# EAGLE design Wiring-Board-Nano_lay (EAGLE 7.4.0)
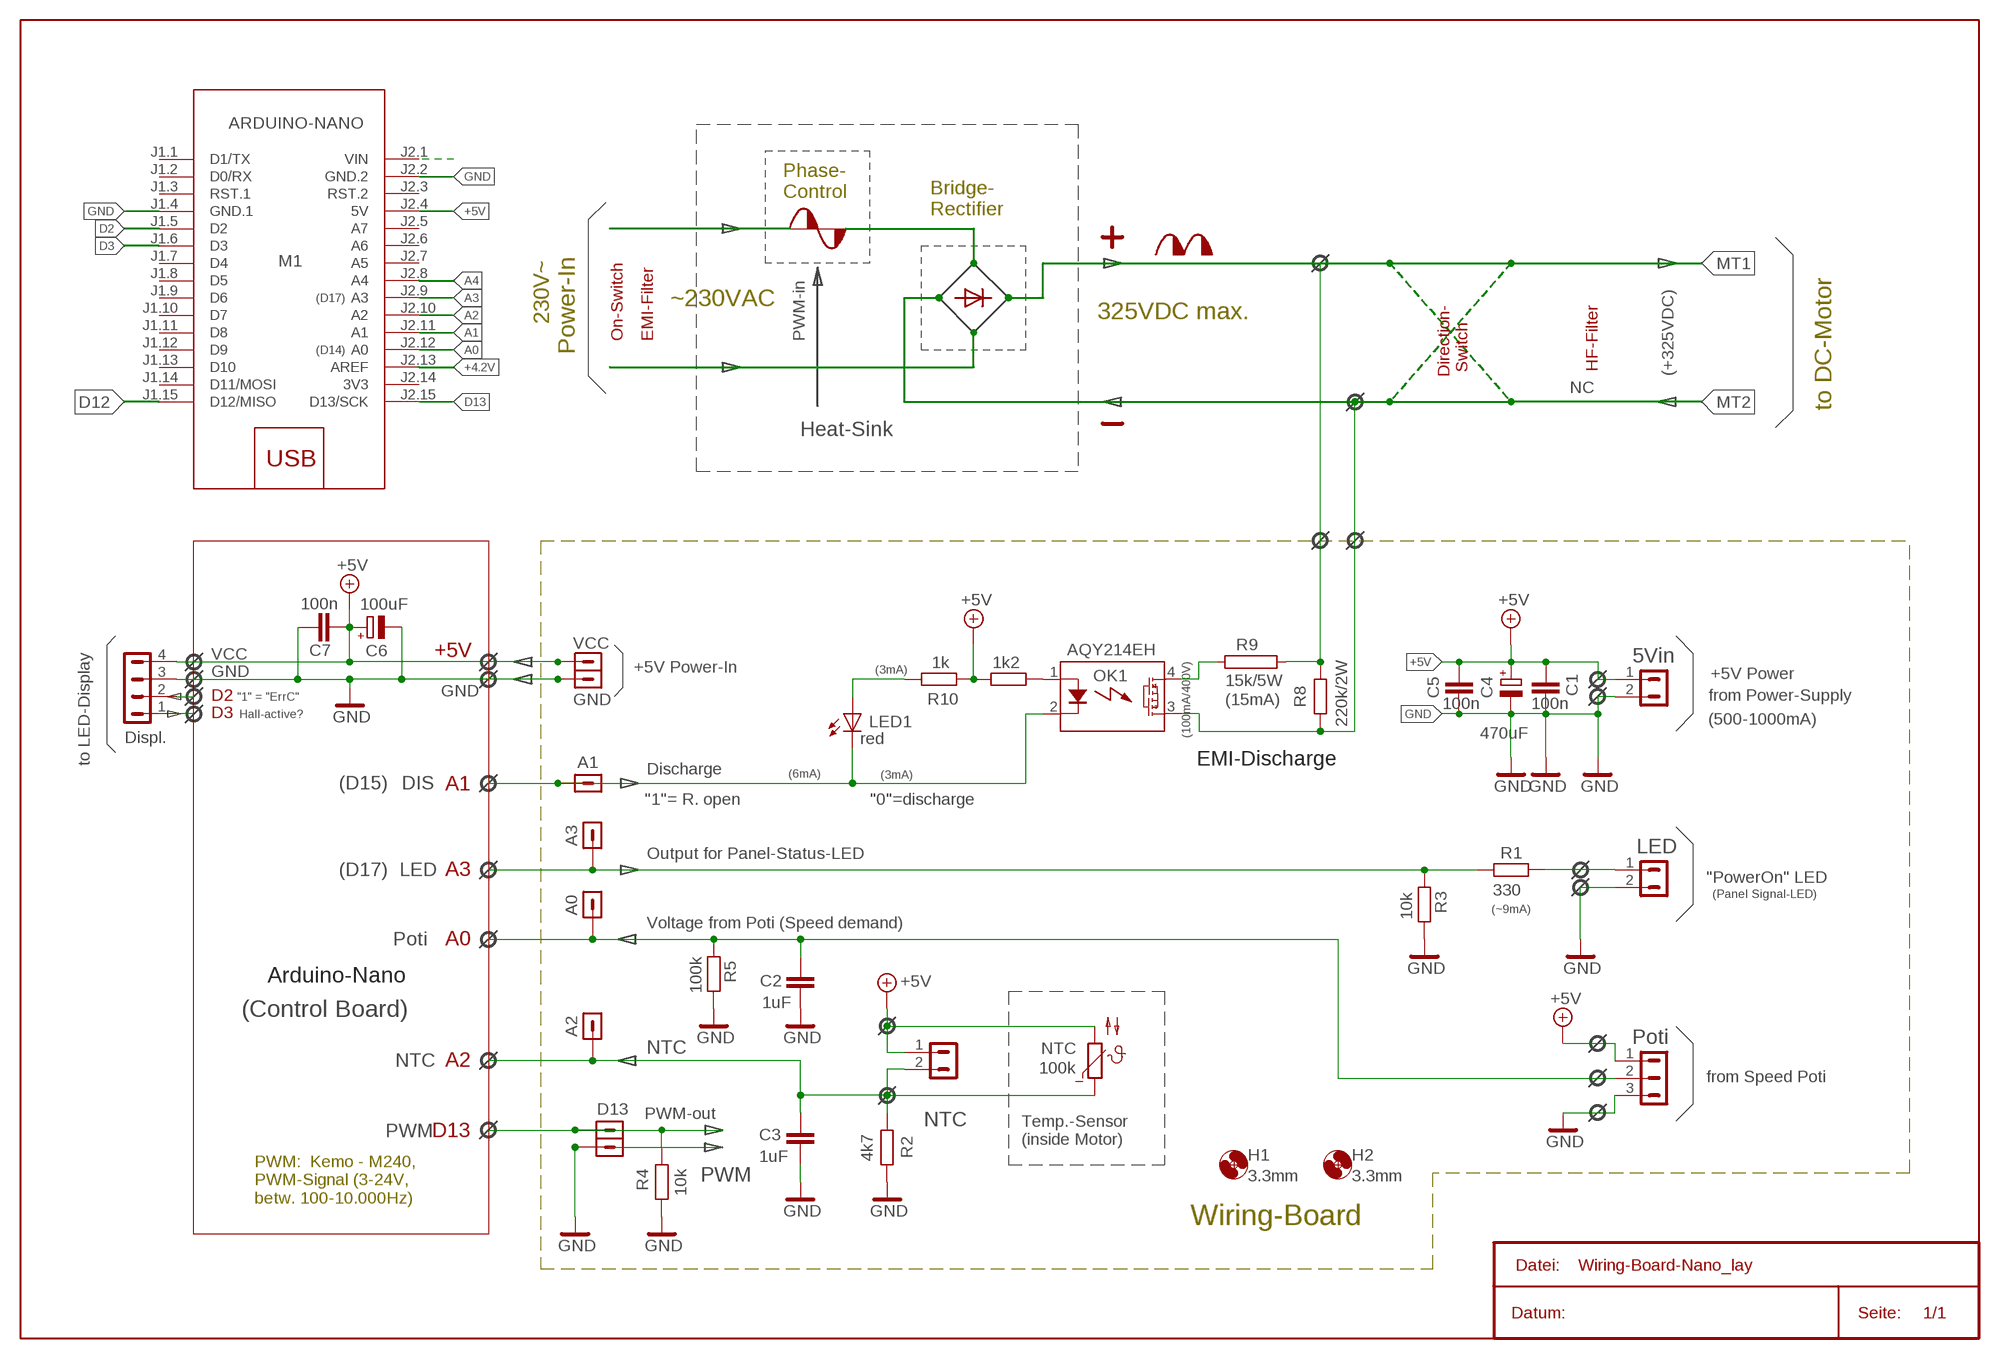
[diagram p0: schematic, sheet 1]

## Parts
C1  100n  C-EUC0805  [C0805]
C2  1uF  C-EUC0805  [C0805]
C3  1uF  C-EUC0805  [C0805]
C4  470uF  CPOL-EUE3.5-8  [E3,5-8]
C5  100n  C-EUC0805  [C0805]
C6  100uF  CPOL-EUE2.5-7  [E2,5-7]
C7  100n  C-EUC0805  [C0805]
H1  3.3mm  MOUNT-HOLE3.3  [3,3]
H2  3.3mm  MOUNT-HOLE3.3  [3,3]
LED1  red  LEDCHIPLED_0805  [CHIPLED_0805]
M1  ARDUINO-NANO  ARDUINO-NANO-3.0  [ARDUINO-NANO-3.0]
OK1  AQY214EH  AQY  [GULLWING]
R1  330  R-EU_R0805  [R0805]
R2  4k7  R-EU_R0805  [R0805]
R3  10k  R-EU_R0805  [R0805]
R4  10k  R-EU_R0805  [R0805]
R5  100k  R-EU_R0805  [R0805]
R8  220k/2W  R-EU_0309/12  [0309/12]
R9  15k/5W  RKH206-8  [KH206-8]
R10  1k  R-EU_R0805  [R0805]
R11  1k2  R-EU_R0805  [R0805]
SV1  5Vin  MA02-10  [MA02-1]
SV2  LED  MA02-10  [MA02-1]
SV3  Poti  MA03-10  [MA03-1]
SV4  NTC  MA02-10  [MA02-1]
SV6  Displ.  MA04-10  [MA04-1]

## Nets
+4.2V: M1.J2.13(AREF)
+5V: C1.1 C4.+ C5.1 C6.+ C7.1 M1.J2.4(5V) R10.2 R11.1 SV1.1 SV3.1 SV4.1 SV6.4
A0: C2.1 M1.J2.12(A0) R5.1 SV3.2
A1: LED1.C M1.J2.11(A1) OK1.2(K)
A2: C3.1 M1.J2.10(A2) R2.2 SV4.2
A3: M1.J2.9(A3) R1.1 R3.1
A4: M1.J2.8(A4)
D2: M1.J1.5(D2) SV6.2
D3: M1.J1.6(D3) SV6.1
D12: M1.J1.15(D12/MISO)
D13: M1.J2.15(D13/SCK) R4.1
GND: C1.2 C2.2 C3.2 C4.- C5.2 C6.- C7.2 M1.J1.4(GND.1) M1.J2.2(GND.2) R2.1 R3.2 R4.2 R5.2 SV1.2 SV2.2 SV3.3 SV6.3
MINUS: OK1.3(DS2) R8.1
MT1: R8.2 R9.2
N$1: OK1.1(A) R11.2
N$3: R1.2 SV2.1
N$7: M1.J2.1(VIN)
N$8: OK1.4(DS1) R9.1
N$18: LED1.A R10.1
Unconnected: M1.J1.1(D1/TX) M1.J1.2(D0/RX) M1.J1.3(RST.1) M1.J1.7(D4) M1.J1.8(D5) M1.J1.9(D6) M1.J1.10(D7) M1.J1.11(D8) M1.J1.12(D9) M1.J1.13(D10) M1.J1.14(D11/MOSI) M1.J2.3(RST.2) M1.J2.5(A7) M1.J2.6(A6) M1.J2.7(A5)

## Notes on the sheet
- Phase-
  Control
- Bridge-
  Rectifier
- (D17)
- ~230VAC
- 230V~ | 325VDC max.
- On-Switch | EMI-Filter | PWM-in
- (D14)
- Power-In
- HF-Filter | (+325VDC)
- Direction-
   Switch
- NC
- to DC-Motor
- Heat-Sink
- VCC
- VCC | +5V
- GND | +5V Power-In | (3mA)
- +5V Power
- D2 | GND
- "1" = "ErrC" | from Power-Supply
- GND | (15mA)
- D3 | Hall-active?
- (500-1000mA)
- (100mA/400V)
- to LED-Display | A1 | EMI-Discharge
- Discharge | (6mA)
- (3mA)
- (D15) | DIS | A1
- "1"= R. open | "0"=discharge
- A3
- Output for Panel-Status-LED
- (D17) | LED | A3
- "PowerOn" LED
- (Panel Signal-LED)
- A0 | (~9mA)
- Voltage from Poti (Speed demand)
- Poti | A0
- Arduino-Nano
- (Control Board)
- A2
- NTC | NTC
- NTC | A2
- 100k
- from Speed Poti
- D13 | PWM-out
- PWM | D13
- Temp.-Sensor
  (inside Motor)
- PWM
- PWM:  Kemo - M240,
  PWM-Signal (3-24V,
  betw. 100-10.000Hz)
- Wiring-Board

## Power pins joined to a net without a drawn wire
3V3: M1.J2.14(3V3)

## Library data of the parts
C1-C3 C5 C7 = rcl1:C-EU: CAPACITOR, European symbol
C4 C6 = rcl1:CPOL-EU: POLARIZED CAPACITOR, European symbol
H1 H2 = holes:MOUNT-HOLE: MOUNTING HOLE with drill center marker
LED1 = led:LED: LED OSRAM: - CHIPLED LG R971, LG N971, LY N971, LG Q971, LY Q971, LO R971, LY R971 LH N974, LH R974 LS Q976, LO Q976, LY Q976 LO Q996 - Hyper CHIPLED LW Q18S LB Q993, LB Q99A, LB R99A - SideLED LS A670, LO A670, LY A670, LG A670, LP A670 LB A673, LV A673, LT A673, LW A673 LH A674 LY A675 LS A676, LA A676, LO A676, LY A676, LW A676 LS A679, LY A679, LG A679 - Hyper Micro SIDELED® LS Y876, LA Y876, LO Y876, LY Y876 LT Y87S - SmartLED LW L88C, LW L88S LB L89C, LB L89S, LG L890 LS L89K, LO L89K, LY L89K LS L896, LA L896, LO L896, LY L896 - TOPLED LS T670, LO T670, LY T670, LG T670, LP T670 LSG T670, LSP T670, LSY T670, LOP T670, LYG T670 LG T671, LOG T671, LSG T671 LB T673, LV T673, LT T673, LW T673 LH T674 LS T676, LA T676, LO T676, LY T676, LB T676, LH T676, LSB T676, LW T676 LB T67C, LV T67C, LT T67C, LS T67K, LO T67K, LY T67K, LW E67C LS E67B, LA E67B, LO E67B, LY E67B, LB E67C, LV E67C, LT E67C LW T67C LS T679, LY T679, LG T679 LS T770, LO T770, LY T770, LG T770, LP T770 LB T773, LV T773, LT T773, LW T773 LH T774 LS E675, LA E675, LY E675, LS T675 LS T776, LA T776, LO T776, LY T776, LB T776 LHGB T686 LT T68C, LB T68C - Hyper Mini TOPLED® LB M676 - Mini TOPLED Santana® LG M470 LS M47K, LO M47K, LY M47K Source: http://www.osram.convergy.de LUXEON: - LUMILED® LXK2-PW12-R00, LXK2-PW12-S00, LXK2-PW14-U00, LXK2-PW14-V00 LXK2-PM12-R00, LXK2-PM12-S00, LXK2-PM14-U00 LXK2-PE12-Q00, LXK2-PE12-R00, LXK2-PE12-S00, LXK2-PE14-T00, LXK2-PE14-U00 LXK2-PB12-K00, LXK2-PB12-L00, LXK2-PB12-M00, LXK2-PB14-N00, LXK2-PB14-P00, LXK2-PB14-Q00 LXK2-PR12-L00, LXK2-PR12-M00, LXK2-PR14-Q00, LXK2-PR14-R00 LXK2-PD12-Q00, LXK2-PD12-R00, LXK2-PD12-S00 LXK2-PH12-R00, LXK2-PH12-S00 LXK2-PL12-P00, LXK2-PL12-Q00, LXK2-PL12-R00 Source: www.luxeon.com KINGBRIGHT: KA-3528ASYC Source: www.kingbright.com
M1 = diy-modules:ARDUINO-NANO-3.0: Arduino Nano 3.0 and compatible devices More details available here: https://www.arduino.cc/en/Main/ArduinoBoardNano Click here to find device on ebay.com <http://www.ebay.com/sch/arduino+nano>
OK1 = relay:AQY*: PhotoMOS Relay NAiS Source: http://www.panasonic-electric-works.com/catalogues/downloads/photomos/ds_x615_en_aqz10_20.pdf
R1-R5 R8 R10 R11 = rcl1:R-EU_: RESISTOR, European symbol
R9 = resistor-power:R: Power Resitor; OC_FARNELL: unknown; OC_NEWARK: unknown
SV1 SV2 SV4 = con-lstc:MA02-1: PIN HEADER
SV3 = con-lstc:MA03-1: PIN HEADER; OC_FARNELL: unknown; OC_NEWARK: unknown
SV6 = con-lstc:MA04-1: PIN HEADER; OC_FARNELL: unknown; OC_NEWARK: unknown

## Board
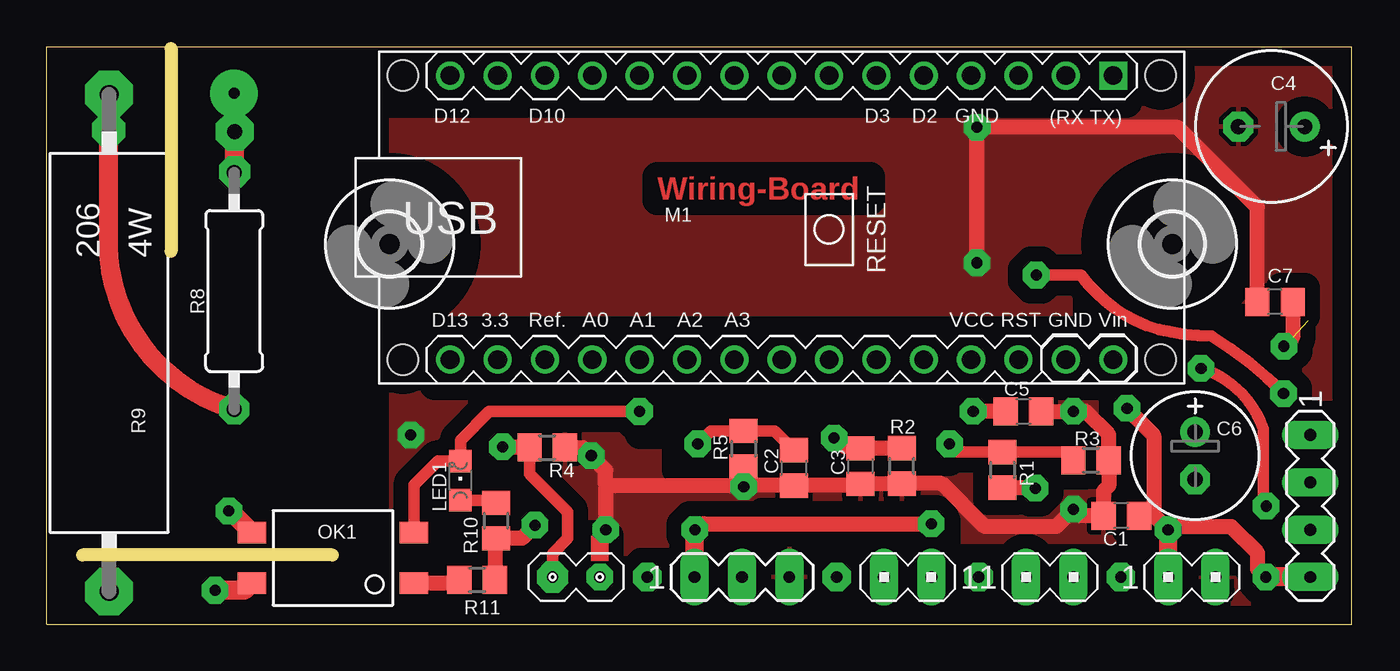
[diagram p1: board, top side]
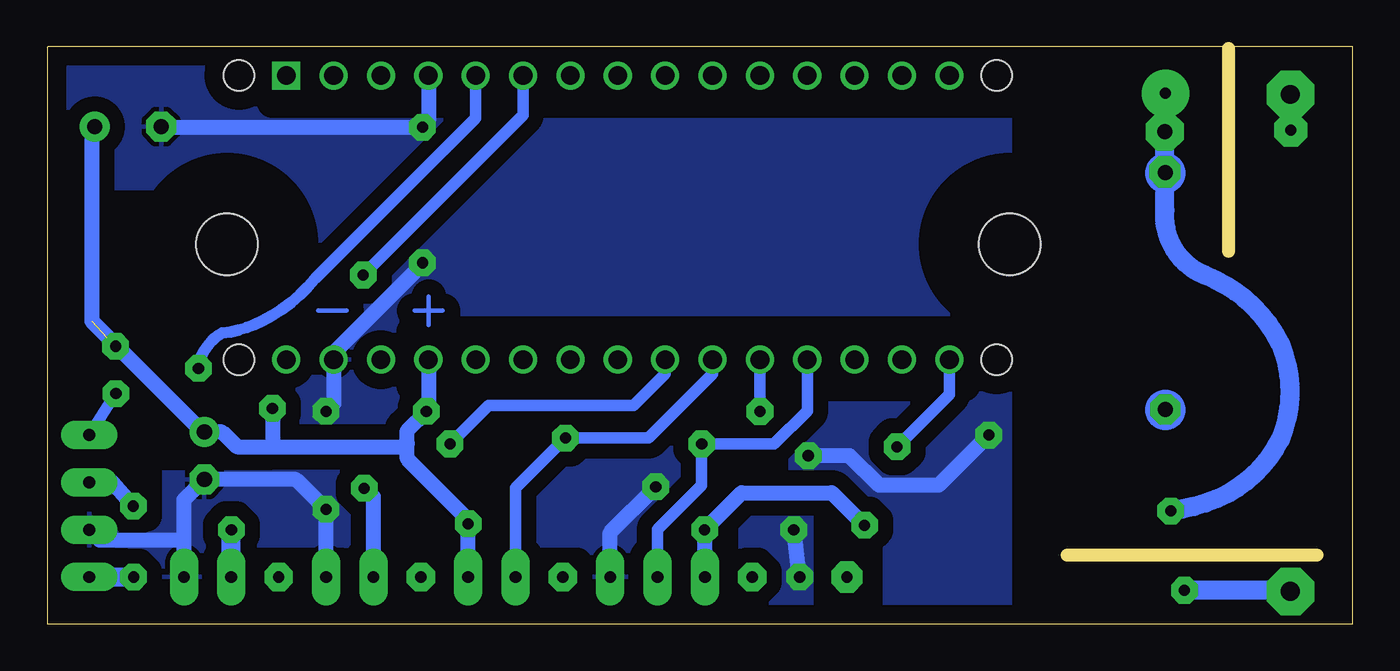
[diagram p2: board, bottom side, seen from below]

Size 70 x 31 mm. Coordinates in mm from the lower left corner, seen from the top.
Outline: 0,0 70,0 70,31 0,31 0,0
Copper layers (1*16): Top 0.035mm / dielectric 1.5mm / Bottom 0.035mm
Design rules "default": minimum track width 10mil, minimum drill 24mil, track to track 8mil, track to pad 8mil, pad to pad 8mil, via to via 8mil, smd to smd 8mil, copper to edge 40mil, drill to drill 8mil, minimum pad ring 10mil, minimum via ring 8mil, stop-mask expansion 4mil, vias tented up to drill 0mil, thermal gap 10mil
tRestrict: area 17.9,28 to 57.9,29; area 20.8,12.9 to 58.4,15.7; area 32.9,12 to 51.6,13.6; area 44.9,1.9 to 61,3.5; area 33.8,8.3 to 46.1,9.2; area 60.2,3.4 to 69.2,11.2; area 57.8,7.5 to 59.4,13.3; area 64.2,15.8 to 65.9,16.4; area 16,1.3 to 17.5,27.4; area 31.8,10.2 to 33.5,10.8; area 32.5,2.7 to 34.5,3.3; area 38.4,5.2 to 40.1,6; 7 more areas
bRestrict: area 17.9,28 to 58,30.3; area 20.8,12.8 to 50.5,15.7; area 54.3,2.5 to 59.2,3.3; area 64.7,5.8 to 65.6,9; area 41.6,2 to 45.2,3.3; area 58.1,9.1 to 64.4,12.7; area 26,1 to 28.1,5.9; area 64.5,16.3 to 69,22.5; area 0.6,26.3 to 3.7,27.5; area 33.8,2.1 to 34.9,5.1; area 54.7,14.2 to 56.3,18.8; area 16,1.3 to 17.5,27.3; 3 more areas
Milling: 2 lines

### Footprints (pad centres in the part's own frame; a part is rotated, then mirrored left to right if it is on the bottom)
C0805 = smd 1.3 x 1.5: 1 -0.95,0; 2 0.95,0
E3,5-8 = drill 0.813 pad 1.6: + -1.778,0 | drill 0.813 pad 1.6 octagon: - 1.778,0
E2,5-7 = drill 0.813 pad 1.6: + -1.27,0 | drill 0.813 pad 1.6 octagon: - 1.27,0
3,3 = hole 3.3: 0,0
CHIPLED_0805 = smd 1.2 x 1.2: A 0,-1.05; C 0,1.05
ARDUINO-NANO-3.0 = drill 1 square: J1.1 17.78,7.62 | drill 1: J1.2 15.24,7.62; J1.3 12.7,7.62; J1.4 10.16,7.62; J1.5 7.62,7.62; J1.6 5.08,7.62; J1.7 2.54,7.62; J1.8 0,7.62; J1.9 -2.54,7.62; J1.10 -5.08,7.62; J1.11 -7.62,7.62; J1.12 -10.16,7.62; J1.13 -12.7,7.62; J1.14 -15.24,7.62; J1.15 -17.78,7.62; J2.1 17.78,-7.62; J2.2 15.24,-7.62; J2.3 12.7,-7.62; J2.4 10.16,-7.62; J2.5 7.62,-7.62; J2.6 5.08,-7.62; J2.7 2.54,-7.62; J2.8 0,-7.62; J2.9 -2.54,-7.62; J2.10 -5.08,-7.62; J2.11 -7.62,-7.62; J2.12 -10.16,-7.62; J2.13 -12.7,-7.62; J2.14 -15.24,-7.62; J2.15 -17.78,-7.62 | hole 1.651: -20.32,7.62; -20.32,-7.62; 20.32,-7.62; 20.32,7.62
GULLWING = smd 1.524 x 1.143: 1 -4.345,1.349; 2 -4.345,-1.349; 3 4.345,-1.349; 4 4.345,1.349
R0805 = smd 1.3 x 1.5: 1 -0.95,0; 2 0.95,0
0309/12 = drill 0.8 pad 1.6 octagon: 1 -6.35,0; 2 6.35,0
KH206-8 = drill 1.016 pad 2.54 octagon: 1 -13.335,0; 2 13.335,0
MA02-1 = drill 0.635 pad 1.524 long: 1 -1.27,0; 2 1.27,0
MA03-1 = drill 0.635 pad 1.524 long: 1 -2.54,0; 2 0,0; 3 2.54,0
MA04-1 = drill 0.635 pad 1.524 long: 1 -3.81,0; 2 -1.27,0; 3 1.27,0; 4 3.81,0

### Placement (x,y rotation side)
C1  57.64,5.83 180 top
C2  40.07,8.4 270 top
C3  43.64,8.49 270 top
C4  65.69,26.71 180 top
C5  52.39,11.43 0 top
C6  61.59,9.05 270 top
C7  65.88,17.3 180 top
H1  60.38,20.4 0 top
H2  18.4,20.4 0 top
LED1  22.2,7.72 0 top
M1  39.42,21.83 0 top
OK1  15.36,3.57 180 top
R1  51.26,8.29 270 top
R2  45.86,8.51 90 top
R3  56.01,8.81 0 top
R4  26.85,9.49 0 top
R5  37.37,9.43 270 top
R8  10.06,17.89 270 top
R9  3.35,15.1 90 top
R10  24.1,5.57 270 top
R11  23.09,2.39 180 top
SV1  61.42,2.54 0 top
SV2  53.8,2.54 0 top
SV3  37.29,2.54 0 top
SV4  46.18,2.54 180 top
SV6  67.77,6.35 270 top

### Tracks (layer width: path | path; a pad name or v marks a point on that pad's centre or on a via)
+5V  (via drill 0.6 pad 1.42)  (1 unrouted)
  Top 0.813: v65.39,2.54 64.95,2.98 64.95,3.83 63.54,5.24 60.31,5.24 v60.15,5.08 59.38,5.85 | C1.1 59.38,5.85 | v34.77,5.08 35.24,5.4 v47.45,5.4 | C5.1 v49.69,11.43 | v26.19,5.32 25.5,4.62 R10.2 24.04,4.56 R11.1 | v57.94,11.59 59.38,10.15 59.38,5.85 | C7.1 66.83,15.4 v66.36,14.92
  Top 1.016: SV6.4 v65.39,2.54
  Bottom 0.813: SV4.1 v47.45,5.4 47.45,5.62 50.72,8.89 50.72,9.68 | SV3.1 34.75,4.91 v34.77,5.08 32.78,7.06 27.94,7.06 v26.19,5.32 | M1.J2.4 49.58,11.54 v49.69,11.43 50.72,10.4 50.72,9.68 | C4.+ 67.63,26.55 67.63,16.27 61.67,10.32 C6.+ 60.64,10.32 59.85,9.53 57.94,9.53 | 57.94,9.53 50.88,9.53 50.72,9.68 | v57.94,11.59 57.94,9.53
  Bottom 1.016: SV1.1 v60.15,5.08 | SV6.4 v65.39,2.54
A0  (via drill 0.6 pad 1.42)
  Top 0.61: C2.1 39.04,10.38 R5.1 35.62,10.38 v34.92,9.68
  Bottom 0.61: M1.J2.12 29.26,11.46 31.04,9.68 v34.92,9.68 34.92,7.46 37.29,5.1 SV3.2
A1  (via drill 0.6 pad 1.42)
  Top 0.61: v31.8,11.42 23.74,11.42 22.2,9.88 LED1.C 20.99,8.77 19.7,7.48 OK1.2
  Bottom 0.61: M1.J2.11 v31.8,11.42 v31.79,11.43
A2  (via drill 0.6 pad 1.42)
  Top 0.61: R2.2 45.53,9.44 | v42.23,10 42.79,9.44 C3.1
  Top 0.813: 45.53,9.44 C3.1
  Bottom 0.61: M1.J2.10 34.34,13.44 37.78,10 v42.23,10 44.91,7.32 SV4.2
A3  (via drill 0.6 pad 1.42)
  Top 0.61: v48.42,9.68 48.86,9.24 R1.1 54.63,9.24 R3.1
  Bottom 0.61: M1.J2.9 36.88,13.44 38.58,11.75 46.35,11.75 v48.42,9.68
D2  (via drill 0.6 pad 1.42)
  Top 0.61: v61.91,13.73 arc-54 65.25,10.48 65.25,6.51 v65.41,6.35
  Bottom 0.61: M1.J1.5 47.04,27.16 55.64,18.56 arc25 58.5,16.27 arc21 60.64,15.64 arc-53 v61.91,13.73
  Bottom 0.813: SV6.2 66.52,7.62 v65.41,6.35
D3  (via drill 0.6 pad 1.42)
  Top 0.61: v53.07,18.74 55.47,18.73 arc30 58.98,16.03 arc18 62.47,15.48 arc-13 v66.34,12.38
  Bottom 0.61: M1.J1.6 44.5,27.32 v53.07,18.74 | SV6.1 v66.34,12.38
D13  (via drill 0.6 pad 1.42, 0.6 pad 1.68)
  Top 0.61: R4.1 25.9,8.08 27.94,6.03 27.94,4.6 27.13,3.79 v27.13,2.54 | 24.48,9.49 v24.45,9.53
  Top 0.813: R4.1 24.48,9.49
  Bottom 0.61: M1.J2.15 21.64,12.33 v24.45,9.53
GND  (via drill 0.6 pad 1.42)
  Top 0.61: R2.1 45.85,7.54
  Top 0.813: 45.85,7.54 C3.2 43.55,7.45 C2.2 37.37,7.45 R5.2 37.39,8.55 v37.39,7.38 37.39,7.46 29.99,7.46 | R2.1 48.01,7.56 50.32,5.24 54.13,5.24 v55.07,6.17 55.41,5.83 C1.2 56.69,7.16 56.96,7.43 R3.2 56.96,10.19 55.72,11.43 v55.07,11.43 C5.2 | v49.9,19.4 v49.9,26.67 60.64,26.67 64.93,22.38 C7.2 | 29.99,7.46 v29.99,5.08 | 29.99,7.46 29.99,8.27 v29.21,9.05 28.77,9.49 R4.2
  Bottom 0.813: M1.J2.2 54.66,14.24 | SV3.3 39.83,4.94 v37.39,7.38 | SV2.2 v55.07,6.17 56.67,7.78 C6.- 62.69,6.68 62.69,4.52 | v29.67,2.54 v29.99,5.08 | v19.53,10.16 22.23,7.46 25.4,7.46 26.99,9.05 v29.21,9.05 | v49.9,19.4 49.9,19.32 54.66,14.55 M1.J2.2 | SV1.2 62.69,4.52 | SV6.3 67.21,4.52 62.69,4.52 | M1.J2.2 54.66,11.84 v55.07,11.43 | M1.J1.4 49.58,26.99 v49.9,26.67 63.88,26.67 C4.-
  pour Top (isolate 0.813): 17.76,31.27 70.31,31.27 70.31,-0.4 17.76,-0.4
  pour Bottom (isolate 0.813): 17.76,31.27 70.31,31.27 70.31,-0.4 17.76,-0.4
MINUS  (via drill 0.6 pad 1.42, 0.6 pad 1.68, 0.6 pad 2.54, 0.8 pad 2.03)
  Top 1.016: v10.09,24.28 v10.09,26.43 | v9.77,6.09 9.85,6.09 OK1.3
  Bottom 0.61: R8.1 v10.09,24.28
  Bottom 0.813: 10.09,28.46 v10.05,28.49
  Bottom 1.016: R8.1 10.08,22.23 arc-73 7.94,18.73 arc42 3.89,15.06 arc44 3.89,9.92 arc33 6.71,7.01 arc21 v9.77,6.09 | v10.09,24.28 v10.09,26.43 10.09,28.46
MT1  (via drill 0.6 pad 1.78)
  Top 1.016: R8.2 arc-70 3.33,19.85 v3.33,26.51 R9.2
  Bottom 1.016: v3.33,26.51 R9.2
N$1
  Top 0.61: 21.98,2.22 R11.2
  Top 0.813: OK1.1 21.98,2.22
N$2
  Bottom 0.254: 48.82,16.83 50.32,16.83
N$3  (via drill 0.6 pad 1.42)
  Top 0.813: R1.2 52.98,7.34 v53.02,7.3
  Bottom 0.813: SV2.1 52.53,6.84 v53.02,7.3
N$5  (via drill 0.6 pad 1.52)
  other vias: 32.21,2.54
N$8  (via drill 0.6 pad 1.42)
  Top 1.016: OK1.4 10.62,1.83 v9.03,1.83
  Bottom 1.016: R9.1 3.44,1.83 v9.03,1.83
N$10
  Bottom 0.254: 49.57,17.58 49.57,16.07
N$11
  Bottom 0.254: 53.98,16.83 55.48,16.83
N$12  (via drill 0.6 pad 1.52)
  other vias: 42.37,2.54
N$13  (via drill 0.6 pad 1.52)
  other vias: 49.99,2.54
N$14  (via drill 0.6 pad 1.52)
  other vias: 57.61,2.54
N$18
  Top 0.61: R10.1 23.96,6.67 LED1.A
(copper drawn outside any net)
  shapes: Bottom circle x2, Top area x3

### Text on the board
Top: Wiring-Board
tNames: D12 | D10 | D3 | D2 | GND | (RX TX) | D13 | 3.3 | Ref. | A0 | A1 | A2 | A3 | VCC | RST | GND | Vin
tValues: GND | +5V | Rev.Det. | +5V | D3 | GND | D2 | GND | +5V | GND | +5V | GND | +5V | GND | +5V | LED-Display | +5V | PWM-Out | Poti | NTC | LED | 5V-In
Document: (Discharge)
Muster: PWM | Poti | DIS. | NTC | LED
Other: cut #0,7mm | Hole ø3.2mm | Hole ø3.2mm | cut #0,7mm
Fem-Pins: Soldered round female Sockets
Kabel_rot: ~325V | +
rost: L
blau: N | -